# Altium project ImmPCB2.PRJPCB (part 2 of 2)

## Sheet Power.SchDoc
size A3
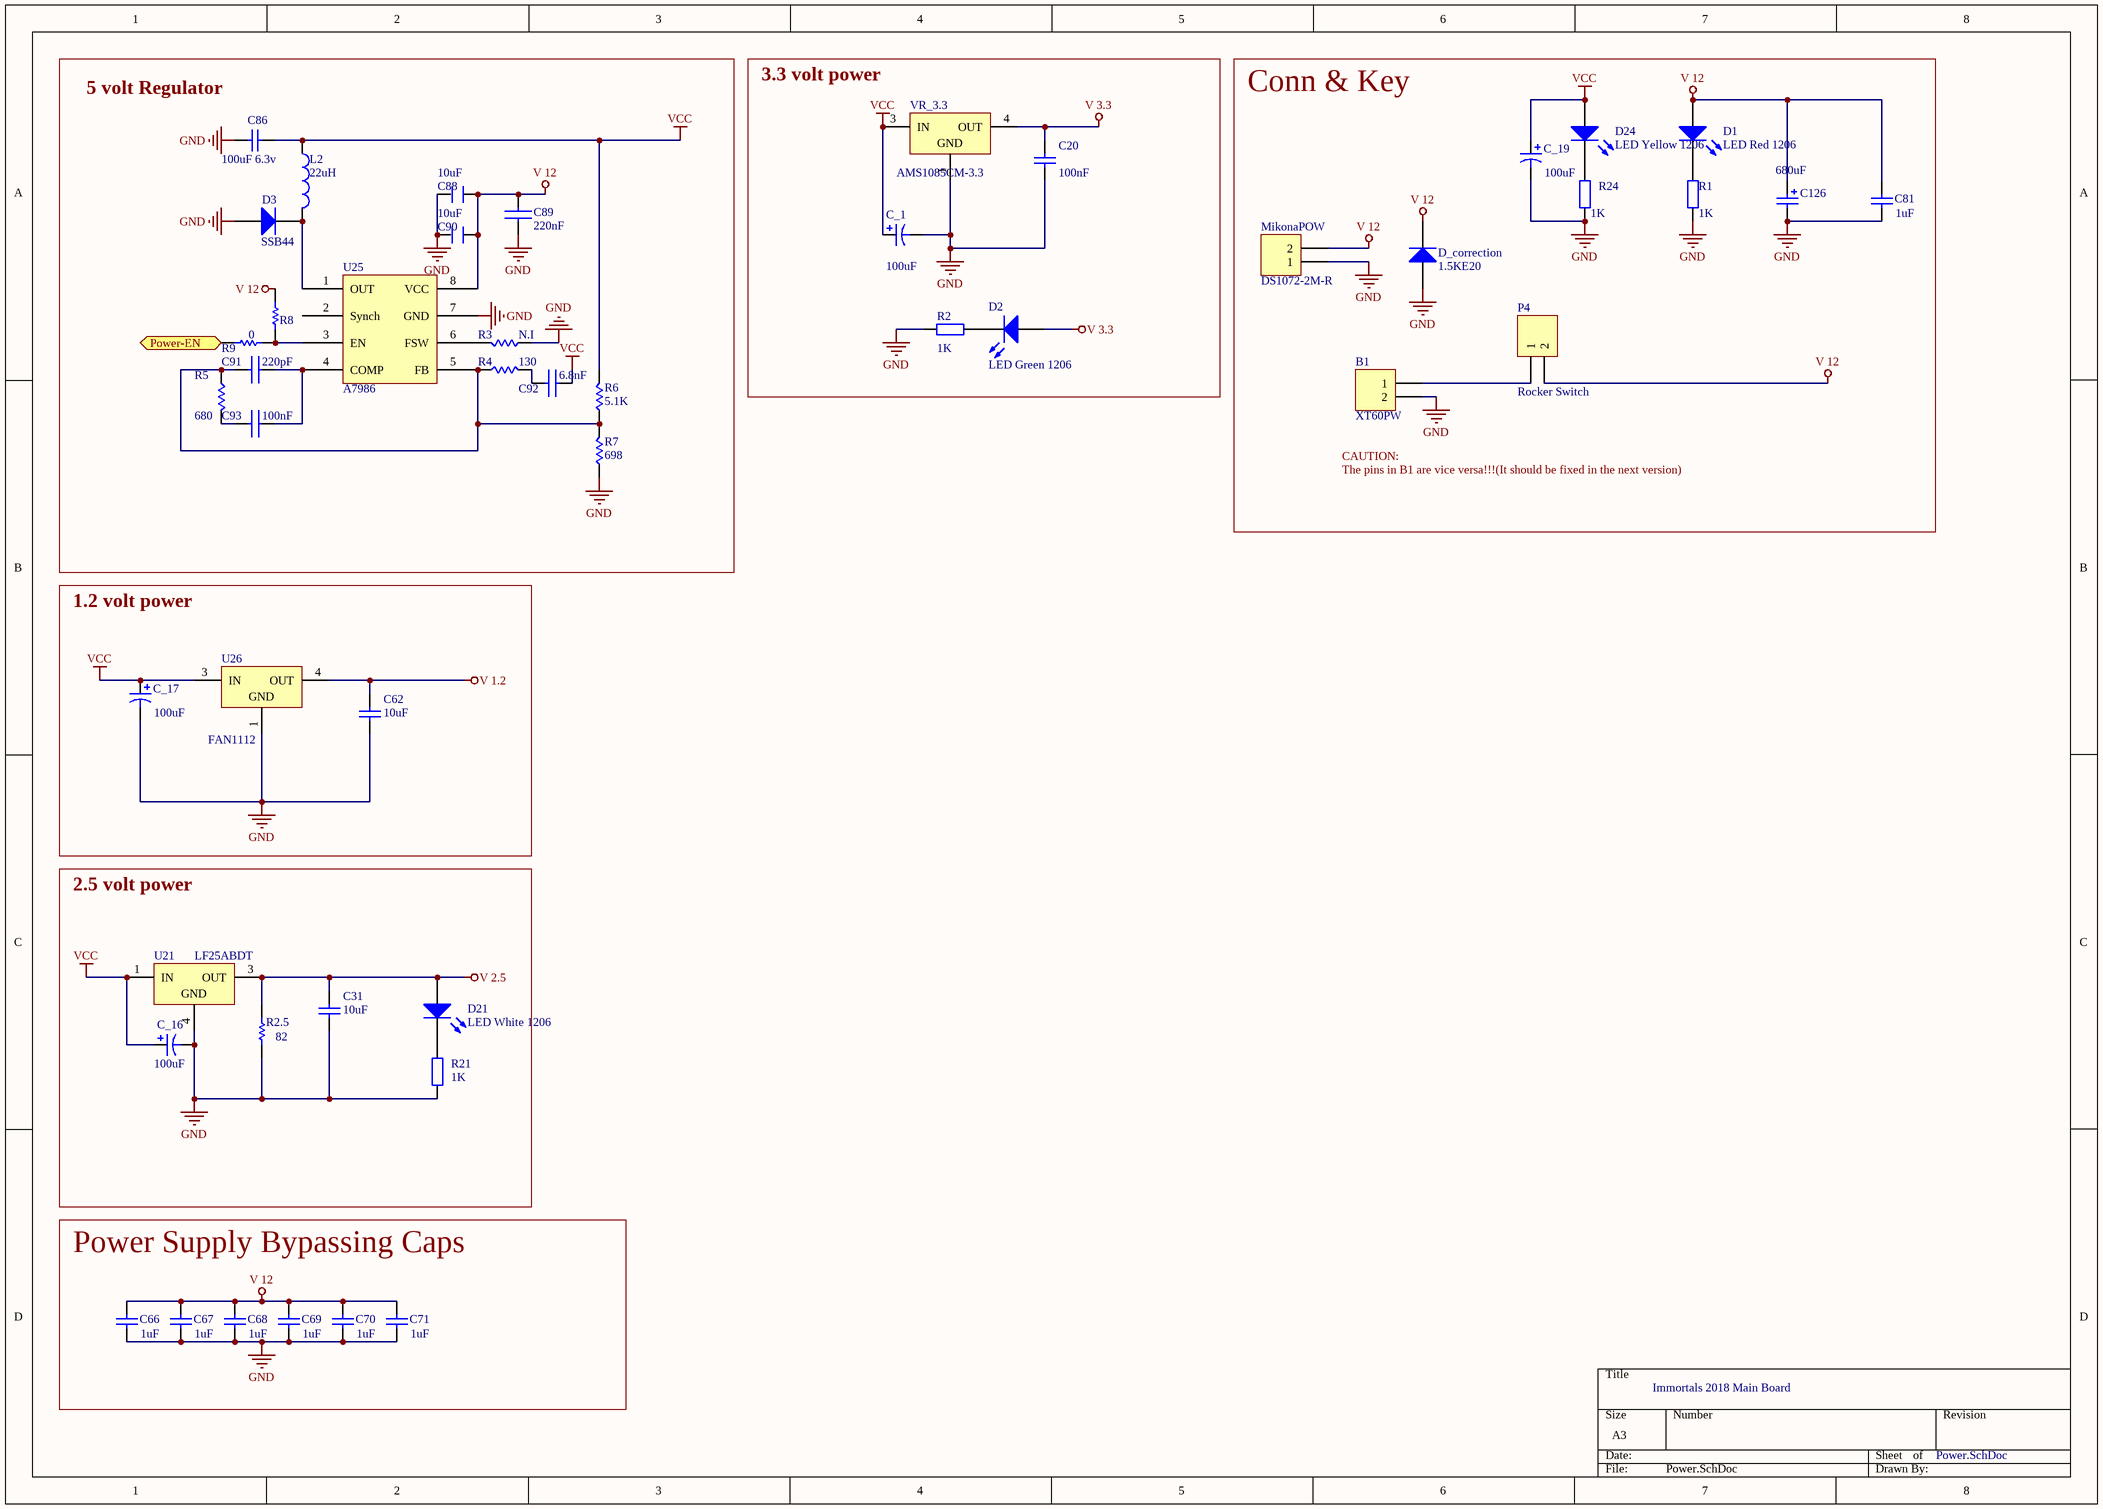
[diagram p4: Power.SchDoc]

### Parts
B1  XT60PW  [XT60PW]
C20  value 100nF  [C1206]  (hidden comment: Cap 100nF 1206)
C31  value 10uF  [C1206]  (hidden comment: Cap 10uF 1206)
C62  value 10uF  [C1206]  (hidden comment: Cap 10uF 1206)
C66  value 1uF  [C0805]  (hidden comment: Cap 1uF 0805)
C67  value 1uF  [C0805]  (hidden comment: Cap 1uF 0805)
C68  value 1uF  [C0805]  (hidden comment: Cap 1uF 0805)
C69  value 1uF  [C0805]  (hidden comment: Cap 1uF 0805)
C70  value 1uF  [C0805]  (hidden comment: Cap 1uF 0805)
C71  value 1uF  [C0805]  (hidden comment: Cap 1uF 0805)
C81  value 1uF  [C0805]  (hidden comment: Cap 1uF 0805)
C86  value 100uF 6.3v  [C1210]  (hidden comment: Cap 100uF 1210)
C88  value 10uF  [C[0805]]  (hidden comment: Cap 10uF 0805)
C89  value 220nF  [C0603]  (hidden comment: Cap 220nF 0603)
C90  value 10uF  [C[0805]]  (hidden comment: Cap 10uF 0805)
C91  value 220pF  [C0603]  (hidden comment: Cap 220pF 0603)
C92  value 6.8nF  [C0603]  (hidden comment: Cap 6.8nF 0603)
C93  value 100nF  [C0603]  (hidden comment: Cap 100nF 0603)
C126  value 680uF  [CAPPR5-5x5]  (hidden comment: Cap 680uF dip)
C_1  value 100uF  [6332[2512]]  (hidden comment: Cap 100uF 2512)
C_16  value 100uF  [6332[2512]]  (hidden comment: Cap 100uF 2512)
C_17  value 100uF  [6332[2512]]  (hidden comment: Cap 100uF 2512)
C_19  value 100uF  [6332[2512]]  (hidden comment: Cap 100uF 2512)
D1  LED Red 1206  [3.2X1.6X1.1 - RED]
D2  LED Green 1206  [3.2X1.6X1.1 - GREEN]
D3  SSB44  [DIOM4336X24N]
D21  LED White 1206  [3.2X1.6X1.1 - WHITE]
D24  LED Yellow 1206  [3.2X1.6X1.1 - YELLOW]
D_correction  1.5KE20  [DO-41]
L2  value 22uH  [INDP110100X50N]  (hidden comment: Inductor 22uH)
MikonaPOW  DS1072-2M-R  [DS1072-2M&F-R]
P4  Rocker Switch  [Rocker_SW]
R1  value 1K  [2012[0805]]  (hidden comment: Res 1K 0805)
R2  value 1K  [2012[0805]]  (hidden comment: Res 1K 0805)
R2.5  value 82  [3216[1206]]  (hidden comment: Res 82 1206)
R3  N.I  [R0603]
R4  value 130  [R0603]  (hidden comment: Res 130 0603)
R5  value 680  [R0603]  (hidden comment: Res 680 0603)
R6  value 5.1K  [R0603]  (hidden comment: Res 5.1K 0603)
R7  value 698  [R0603]  (hidden comment: Res 698 0603)
R8  N.I  [R0603]  (value not drawn)
R9  value 0  [R0603]  (hidden comment: Res 0 0603)
R21  value 1K  [2012[0805]]  (hidden comment: Res 1K 0805)
R24  value 1K  [2012[0805]]  (hidden comment: Res 1K 0805)
U21  LF25ABDT  [TO-252]
U25  A7986  [HSOP8]
U26  FAN1112  [TO-252]
VR_3.3  AMS1085CM-3.3  [936-03]

### Blocks framed on the sheet
5 volt Regulator: C86 C88-C93 D3 L2 R3-R9 U25
3.3 volt power: C20 C_1 D2 R2 VR_3.3
Conn & Key: B1 C81 C126 C_19 D1 D24 D_correction MikonaPOW P4 R1 R24
1.2 volt power: C62 C_17 U26
2.5 volt power: C31 C_16 D21 R2.5 R21 U21
Power Supply Bypassing Caps: C66-C71

### Ports
Power-EN (in)

### Nets
GND: B1.2 C20.2 C31.1 C62.1 C66.2 C67.2 C68.2 C69.2 C70.2 C71.2 C81.2 C86.1 C88.2 C89.2 C90.2 C126.2 C_1.2 C_16.2 C_17.2 C_19.2 D3.2(A) D_correction.1(A) MikonaPOW.1 R1.2 R2.1 R2.5.1 R3.1 R7.1 R21.1 R24.1 U21.4(GND) U25.7(GND) U26.1(GND) VR_3.3.1(GND)
V 1.2: C62.2 U26.4(OUT)
V 2.5: C31.2 D21.1(A) R2.5.2 U21.3(OUT)
V 3.3: C20.1 D2.1(A) VR_3.3.4(OUT)
V 12: C66.1 C67.1 C68.1 C69.1 C70.1 C71.1 C81.1 C88.1 C89.1 C90.1 C126.1 D1.1(A) D_correction.2(K) MikonaPOW.2 P4.2 R8.1 U25.8(VCC)
VCC: C86.2 C92.1 C_1.1 C_16.1 C_17.1 C_19.1 D24.1(A) L2.1 R6.2 U21.1(IN) U26.3(IN) VR_3.3.3(IN)
P0.05/AIN3: R9.1 ; port Power-EN
NetB1_1: B1.1 P4.1
NetC91_1: C91.1 R4.1 R5.1 R6.1 R7.2 U25.5(FB)
NetC91_2: C91.2 C93.2 U25.4(COMP)
NetC92_2: C92.2 R4.2
NetC93_1: C93.1 R5.2
NetD1_2: D1.2(K) R1.1
NetD2_2: D2.2(K) R2.2
NetD3_1: D3.1(K) L2.2 U25.1(OUT)
NetD21_2: D21.2(K) R21.2
NetD24_2: D24.2(K) R24.2
NetR3_2: R3.2 U25.6(FSW)
NetR8_2: R8.2 R9.2 U25.3(EN)

Not connected (* = marked no-connect by the designer): U25 2(Synch)

### Notes on the sheet
- The pins in B1 are vice versa!!!(It should be fixed in the next version)
- CAUTION:
- Immortals 2018 Main Board

### Library data of the parts
B1 = XT60PW: Power Connector; LatestRevisionDate: 17-Jul-2002; LatestRevisionNote: Re-released for DXP Platform.; Publisher: Altium Limited
C20 C31 C62 C86 = Cap Semi: Capacitor (Semiconductor SIM Model); Published: 8-Jun-2000; PackageReference: C1206; Publisher: Altium Limited
  C20 C31 C62: LatestRevisionDate: 17-Jul-2002; LatestRevisionNote: Re-released for DXP Platform.
  C86: LatestRevisionDate: 29-May-2009; LatestRevisionNote: IPC-7351 Footprint Added.; PackageDescription: Chip Capacitor
C66-C71 C81 = CAP: Capacitor; Fitted: True
C88 C90 = C: Cap , SMD; Part Field 1: 2064
C89 C91 C92 = Cap 0603: C0603
C93 = Cap 0603: Cap SMD 0603
C126 = Cap Pol1: Polarized Capacitor (Radial); Published: 8-Jun-2000; LatestRevisionDate: 17-Jul-2002; LatestRevisionNote: Re-released for DXP Platform.; PackageReference: RB7.6-15; Publisher: Altium Limited
C_1 C_16 C_17 C_19 = Cap Pol3: Polarized Capacitor (Surface Mount); Published: 8-Jun-2000; LatestRevisionDate: 17-Jul-2002; LatestRevisionNote: Re-released for DXP Platform.; PackageReference: C0805; Publisher: Altium Limited
D1 D2 D21 D24 = LED2: Typical RED, GREEN, YELLOW, AMBER GaAs LED; Published: 8-Jun-2000; LatestRevisionDate: 17-Jul-2002; LatestRevisionNote: Re-released for DXP Platform.; PackageDocument: Feb-2002; PackageReference: 3.2X1.6X1.1; Publisher: Altium Limited
D3 = Diode SSB44: 1 Amp General Purpose Rectifier; Published: 8-Jun-2000; LatestRevisionDate: 17-Jul-2002; LatestRevisionNote: Re-released for DXP Platform.; DatasheetDocument: 1998; PackageDocument: Aug-1999; PackageReference: DO-41; Publisher: Altium Limited; Code_JEDEC: DO-204-AL; ComponentLink1Description: Manufacturer Link; ComponentLink1URL: http://www.fairchildsemi.com/; ComponentLink2Description: Datasheet; ComponentLink2URL: http://www.fairchildsemi.com/ds/1N%2F1N4001.pdf
D_correction = Diode 1N4001: 1 Amp General Purpose Rectifier; Published: 8-Jun-2000; LatestRevisionDate: 17-Jul-2002; LatestRevisionNote: Re-released for DXP Platform.; DatasheetDocument: 1998; PackageDocument: Aug-1999; PackageReference: DO-41; Publisher: Altium Limited; Code_JEDEC: DO-204-AL; ComponentLink1Description: Manufacturer Link; ComponentLink1URL: http://www.fairchildsemi.com/; ComponentLink2Description: Datasheet; ComponentLink2URL: http://www.fairchildsemi.com/ds/1N%2F1N4001.pdf
L2 = 7447714220 WE-PD SMD
MikonaPOW = Header 2: Right Angle 3.96mm Power pin; LatestRevisionDate: 17-Jul-2002; LatestRevisionNote: Re-released for DXP Platform.; Publisher: Altium Limited; Value: DS1072-2M-R
P4 = Rocker_SW: I/O Power Switch; LatestRevisionDate: 17-Jul-2002; LatestRevisionNote: Re-released for DXP Platform.; Publisher: Altium Limited
R1 R2 R21 R24 = Res2: Resistor; Published: 8-Jun-2000; LatestRevisionDate: 17-Jul-2002; LatestRevisionNote: Re-released for DXP Platform.; PackageReference: AXIAL-0.4; Publisher: Altium Limited
R2.5 = Res Semi: Semiconductor Resistor; Published: 8-Jun-2000; LatestRevisionDate: 17-Jul-2002; LatestRevisionNote: Re-released for DXP Platform.; PackageReference: AXIAL-0.5; Publisher: Altium Limited
R3-R7 = Res 0603
  R3: Value: N.I
R8 R9 = R0603: Res 0603; Part Field 1: 3144
  R8: Value: N.I
U21 = LF25ABDT: 500mA, Very Low Drop (0.45V) Voltage Regulator; Published: 24-Aug-2001; LatestRevisionDate: 06-Jun-2005; LatestRevisionNote: PCB pads lengthened.; DatasheetVersion: Feb-2004; PackageVersion: Jun-2004; PackageReference: TO-252; Publisher: Altium Limited; PackageDescription: D-PAK/TO-252-AA; 3 Leads (1 Cropped); Body 10.1 (inc. leads) x 6.6 mm (LxW max); ComponentLink1Description: Manufacturer Link; ComponentLink1URL: http://www.st.com/; ComponentLink2Description: Datasheet; ComponentLink2URL: http://www.st.com/stonline/books/pdf/docs/2574.pdf
U25 = A7986: DC\DC Regulator
U26 = FAN1112: 500mA, Very Low Drop (0.45V) Voltage Regulator; Published: 24-Aug-2001; LatestRevisionDate: 06-Jun-2005; LatestRevisionNote: PCB pads lengthened.; DatasheetVersion: Feb-2004; PackageVersion: Jun-2004; PackageReference: TO-252; Publisher: Altium Limited; PackageDescription: D-PAK/TO-252-AA; 3 Leads (1 Cropped); Body 10.1 (inc. leads) x 6.6 mm (LxW max); ComponentLink1Description: Manufacturer Link; ComponentLink1URL: http://www.st.com/; ComponentLink2Description: Datasheet; ComponentLink2URL: http://www.st.com/stonline/books/pdf/docs/2574.pdf
VR_3.3 = LT1585ACM-1.5: 5A Low Dropout Fast Response Positive Fixed Voltage Regulator; Published: 15-Apr-2002; DatasheetVersion: 1999; PackageVersion: 1997; PackageReference: 936-03; Publisher: Altium Limited; PackageDescription: D2-PAK/TO-263-AB; 3 Leads (1 Cropped); Body 14.7 (inc. leads) x 10.2 mm (LxW max); ComponentLink1Description: Manufacturer Link; ComponentLink1URL: http://www.onsemi.com/site/products/taxonomy/0,4438,503,00.html

## Sheet Switches.SchDoc
size A4
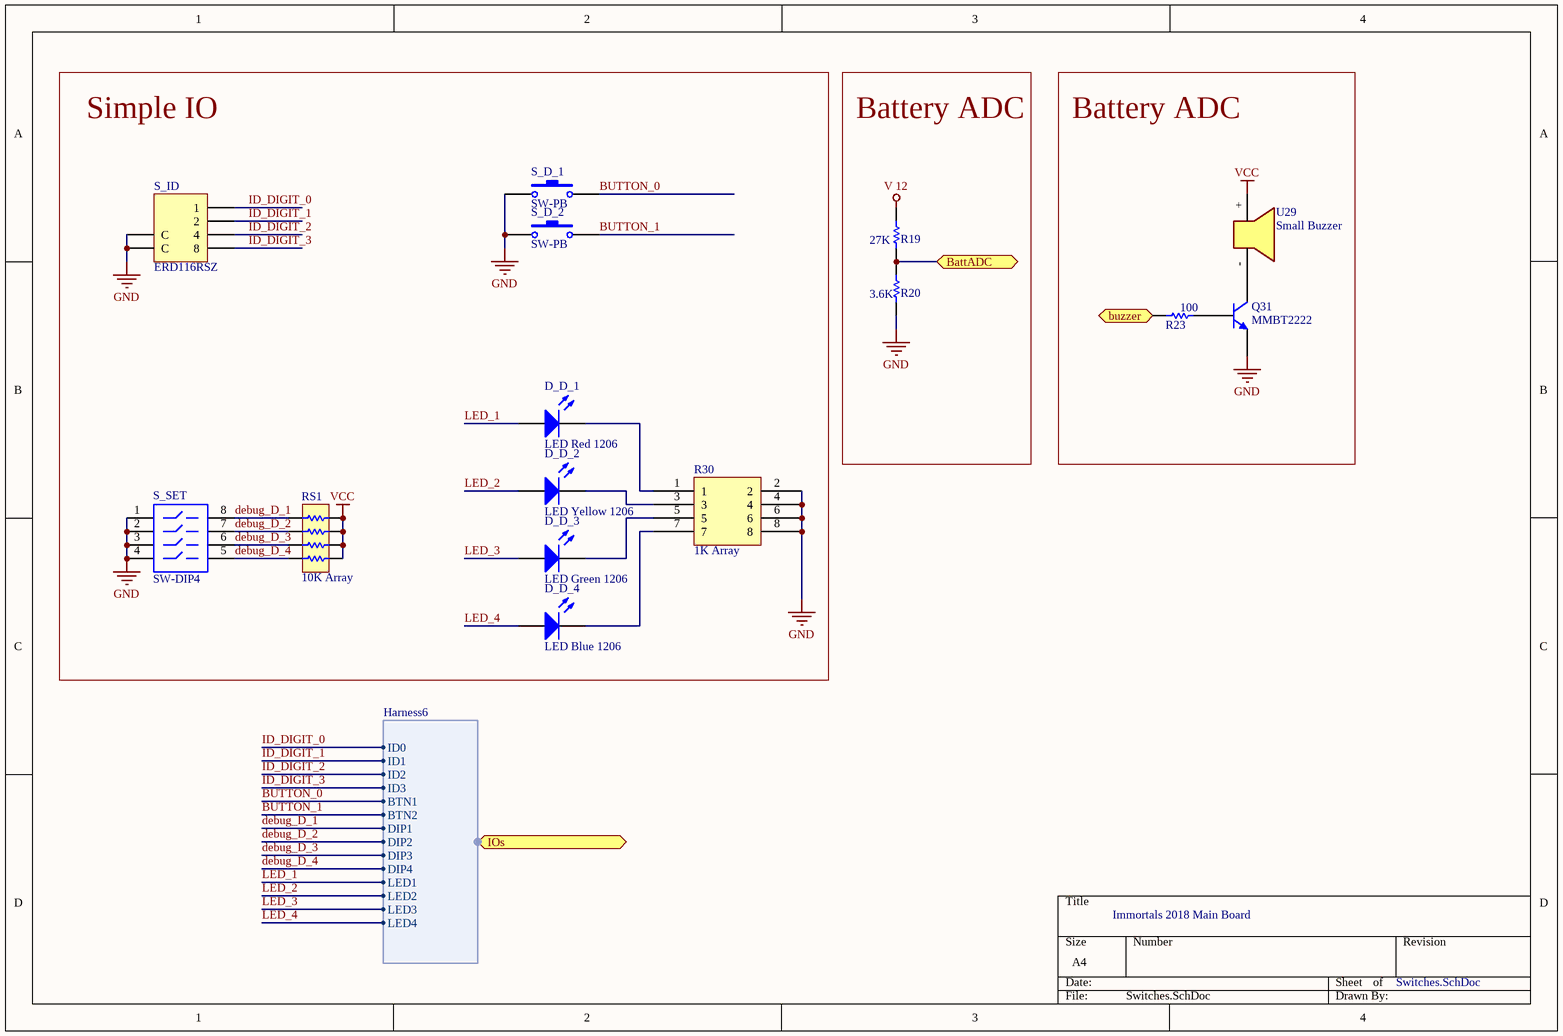
[diagram p5: Switches.SchDoc]

### Parts
D_D_1  LED Red 1206  [3.2X1.6X1.1 - RED]
D_D_2  LED Yellow 1206  [3.2X1.6X1.1 - YELLOW]
D_D_3  LED Green 1206  [3.2X1.6X1.1 - GREEN]
D_D_4  LED Blue 1206  [3.2X1.6X1.1 - BLUE]
Q31  MMBT2222  [SOT23]
R19  value 27K  [R0603]  (hidden comment: Res 27K 0603)
R20  value 3.6K  [R0603]  (hidden comment: Res 3.6K 0603)
R23  value 100  [R0603]  (hidden comment: Res 100 0603)
R30  1K Array  [RES-0603x4]
RS1  10K Array  [RES-4B]
S_D_1  SW-PB  [SPST-2]
S_D_2  SW-PB  [SPST-2]
S_ID  ERD116RSZ  [ERD116RSZ]
S_SET  SW-DIP4  [DIP-8-SW]
U29  Small Buzzer  [my_BUZZER]

### Blocks framed on the sheet
Simple IO: D_D_1-D_D_4 R30 RS1 S_D_1 S_D_2 S_ID S_SET
Battery ADC: R19 R20
Battery ADC: Q31 R23 U29

### Ports
BattADC, buzzer, IOs (harness Harness6)

### Harnesses
Harness6: ID0, ID1, ID2, ID3, BTN1, BTN2, DIP1, DIP2, DIP3, DIP4, LED1, LED2, LED3, LED4

### Nets
GND: Q31.2(E) R20.1 R30.2 R30.4 R30.6 R30.8 S_D_1.1 S_D_2.1 S_ID.2(C) S_ID.5(C) S_SET.1 S_SET.2 S_SET.3 S_SET.4
V 12: R19.2
VCC: RS1.1 RS1.3 RS1.5 RS1.7 U29.+
BT-ADC: R19.1 R20.2 ; port BattADC
BUTTON_0: S_D_1.2 ; port IOs.BTN1  [project net BTN1]
BUTTON_1: S_D_2.2 ; port IOs.BTN2  [project net BTN2]
buzzer: R23.2 ; port buzzer
debug_D_1: RS1.8 S_SET.8 ; port IOs.DIP1  [project net D_IO2]
debug_D_2: RS1.6 S_SET.7 ; port IOs.DIP2  [project net D_IO3]
debug_D_3: RS1.4 S_SET.6 ; port IOs.DIP3  [project net D_IO4]
debug_D_4: RS1.2 S_SET.5 ; port IOs.DIP4  [project net D_IO5]
ID_DIGIT_0: S_ID.1 ; port IOs.ID0  [project net ID0]
ID_DIGIT_1: S_ID.4(2) ; port IOs.ID1  [project net ID1]
ID_DIGIT_2: S_ID.3(4) ; port IOs.ID2  [project net ID2]
ID_DIGIT_3: S_ID.6(8) ; port IOs.ID3  [project net ID3]
LED_1: D_D_1.1(A) ; port IOs.LED1  [project net LED1]
LED_2: D_D_2.1(A) ; port IOs.LED2  [project net LED2]
LED_3: D_D_3.1(A) ; port IOs.LED3  [project net LED3]
LED_4: D_D_4.1(A) ; port IOs.LED4  [project net D_IO6]
NetD_D_1_2: D_D_1.2(K) R30.1
NetD_D_2_2: D_D_2.2(K) R30.3
NetD_D_3_2: D_D_3.2(K) R30.5
NetD_D_4_2: D_D_4.2(K) R30.7
NetQ31_1: Q31.1(B) R23.1
NetQ31_3: Q31.3(C) U29.-

### Notes on the sheet
- Immortals 2018 Main Board

### Library data of the parts
D_D_1-D_D_4 = LED2: as D1 on sheet Power; Published: 8-Jun-2000; LatestRevisionDate: 17-Jul-2002; LatestRevisionNote: Re-released for DXP Platform.; PackageDocument: Feb-2002; PackageReference: 3.2X1.6X1.1; Publisher: Altium Limited
Q31 = MMBT2222ALT1: Transistor NPN Silicon,SMD; Value: MMBT3904; Published: 29-Sep-2000; LatestRevisionDate: 17-Jul-2002; LatestRevisionNote: Re-released for DXP Platform.; DatasheetVersion: 1996; PackageVersion: 1997; PackageReference: 318-08; Publisher: Altium Limited; PackageDescription: SOT-23; 3 Leads; Body 3.0 x 2.6 mm, inc. leads (LxW max); ComponentLink1Description: Manufacturer Link; ComponentLink1URL: http://www.onsemi.com/site/products/landing?taxonomyID=194; ComponentLink2Description: Datasheet; ComponentLink2URL: http://www.onsemi.com/pub/Collateral/MMBT2222LT1-D.PDF
R19 R20 R23 = R0603: Res 0603; Part Field 1: 3144
R30 = RES 0603x4: Array resistors; Value: 1K
RS1 = Resister Array: Resistor Array ,SMD
S_D_1 S_D_2 = SW-PB: Switch; Value: Mini push button; Published: 24-Mar-1999; LatestRevisionDate: 17-Jul-2002; LatestRevisionNote: Re-released for DXP Platform.; PackageReference: SPST-2; Publisher: Altium Limited
S_ID = Rotary Switch: Value: ERD116RSZ
S_SET = SW-DIP4: DIP Switch; Published: 24-Mar-1999; LatestRevisionDate: 17-Jul-2002; LatestRevisionNote: Re-released for DXP Platform.; PackageReference: DIP-8; Publisher: Altium Limited
U29 = my_Buzzer

## Sheet NRF&Gyro.SchDoc
size A
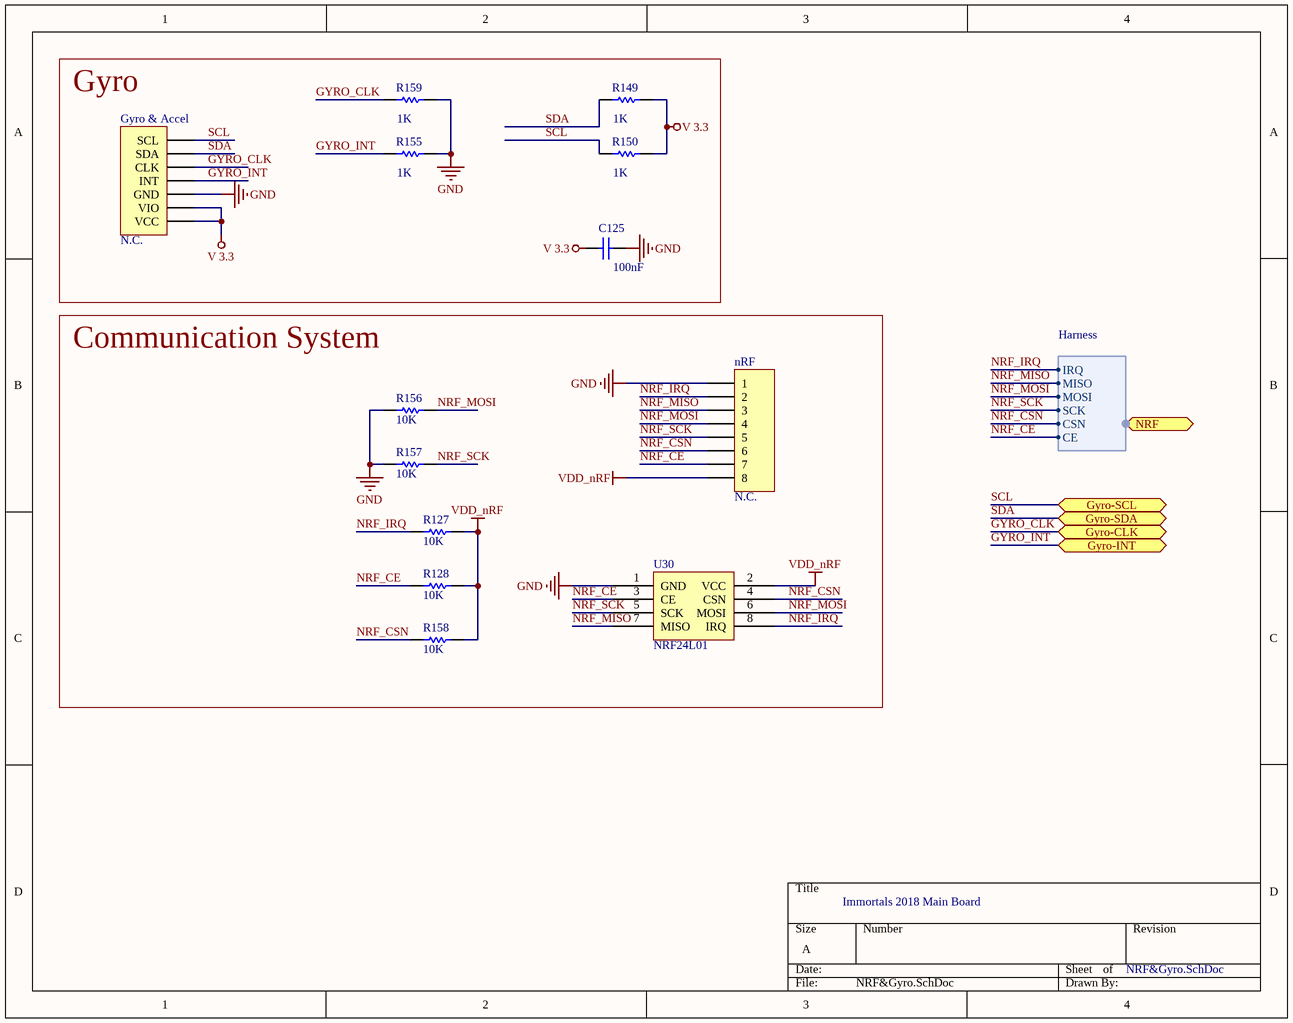
[diagram p6: NRF&Gyro.SchDoc]

### Parts
C125  value 100nF  [C1206]  (hidden comment: Cap 100nF 1206)
Gyro_&_Accel  N.C.  [Gyro_7pin]
nRF  N.C.  [HDR1X8]
R127  value 10K  [1608[0603]]  (hidden comment: Res 10K 0603)
R128  value 10K  [1608[0603]]  (hidden comment: Res 10K 0603)
R149  value 1K  [1608[0603]]  (hidden comment: Res 1K 0603)
R150  value 1K  [1608[0603]]  (hidden comment: Res 1K 0603)
R155  value 1K  [1608[0603]]  (hidden comment: Res 1K 0603)
R156  value 10K  [1608[0603]]  (hidden comment: Res 10K 0603)
R157  value 10K  [1608[0603]]  (hidden comment: Res 10K 0603)
R158  value 10K  [1608[0603]]  (hidden comment: Res 10K 0603)
R159  value 1K  [1608[0603]]  (hidden comment: Res 1K 0603)
U30  NRF24L01  [NRF24L01]

### Blocks framed on the sheet
Gyro: C125 Gyro_&_Accel R149 R150 R155 R159
Communication System: nRF R127 R128 R156-R158 U30

### Ports
Gyro-CLK, Gyro-INT, Gyro-SCL, Gyro-SDA, NRF (harness Harness)

### Harnesses
Harness: IRQ, MISO, MOSI, SCK, CSN, CE

### Nets
GND: C125.2 Gyro_&_Accel.5(GND) nRF.1 R155.2 R156.2 R157.2 R159.2 U30.1(GND)
V 3.3: C125.1 Gyro_&_Accel.6(VIO) Gyro_&_Accel.7(VCC) R149.1 R150.1
VDD_nRF: nRF.8 R127.1 R128.1 R158.1 U30.2(VCC)
GYRO_CLK: Gyro_&_Accel.3(CLK) R159.1 ; port Gyro-CLK  [project net Gyro2]
GYRO_INT: Gyro_&_Accel.4(INT) R155.1 ; port Gyro-INT  [project net Gyro1]
NRF_CE: nRF.7 R128.2 U30.3(CE) ; port NRF.CE  [project net D_IO15_1]
NRF_CSN: nRF.6 R158.2 U30.4(CSN) ; port NRF.CSN  [project net D_IO14]
NRF_IRQ: nRF.2 R127.2 U30.8(IRQ) ; port NRF.IRQ  [project net D_IO10]
NRF_MISO: nRF.3 U30.7(MISO) ; port NRF.MISO  [project net D_IO11]
NRF_MOSI: nRF.4 R156.1 U30.6(MOSI) ; port NRF.MOSI  [project net D_IO12]
NRF_SCK: nRF.5 R157.1 U30.5(SCK) ; port NRF.SCK  [project net D_IO13]
SCL: Gyro_&_Accel.1(SCL) R150.2 ; port Gyro-SCL  [project net Gyro4]
SDA: Gyro_&_Accel.2(SDA) R149.2 ; port Gyro-SDA  [project net Gyro3]

### Notes on the sheet
- Immortals 2018 Main Board

### Library data of the parts
C125 = CAP: Capacitor; Fitted: True
Gyro_&_Accel = Gyroscope: Comp & Gyro
nRF = Header 8: Header, 8-Pin; LatestRevisionDate: 17-Jul-2002; LatestRevisionNote: Re-released for DXP Platform.; Publisher: Altium Limited
R127 R128 R149 R150 R155-R159 = Res Semi: Semiconductor Resistor; Published: 8-Jun-2000; LatestRevisionDate: 17-Jul-2002; LatestRevisionNote: Re-released for DXP Platform.; PackageReference: AXIAL-0.5; Publisher: Altium Limited

## Sheet MCU.SchDoc
size A
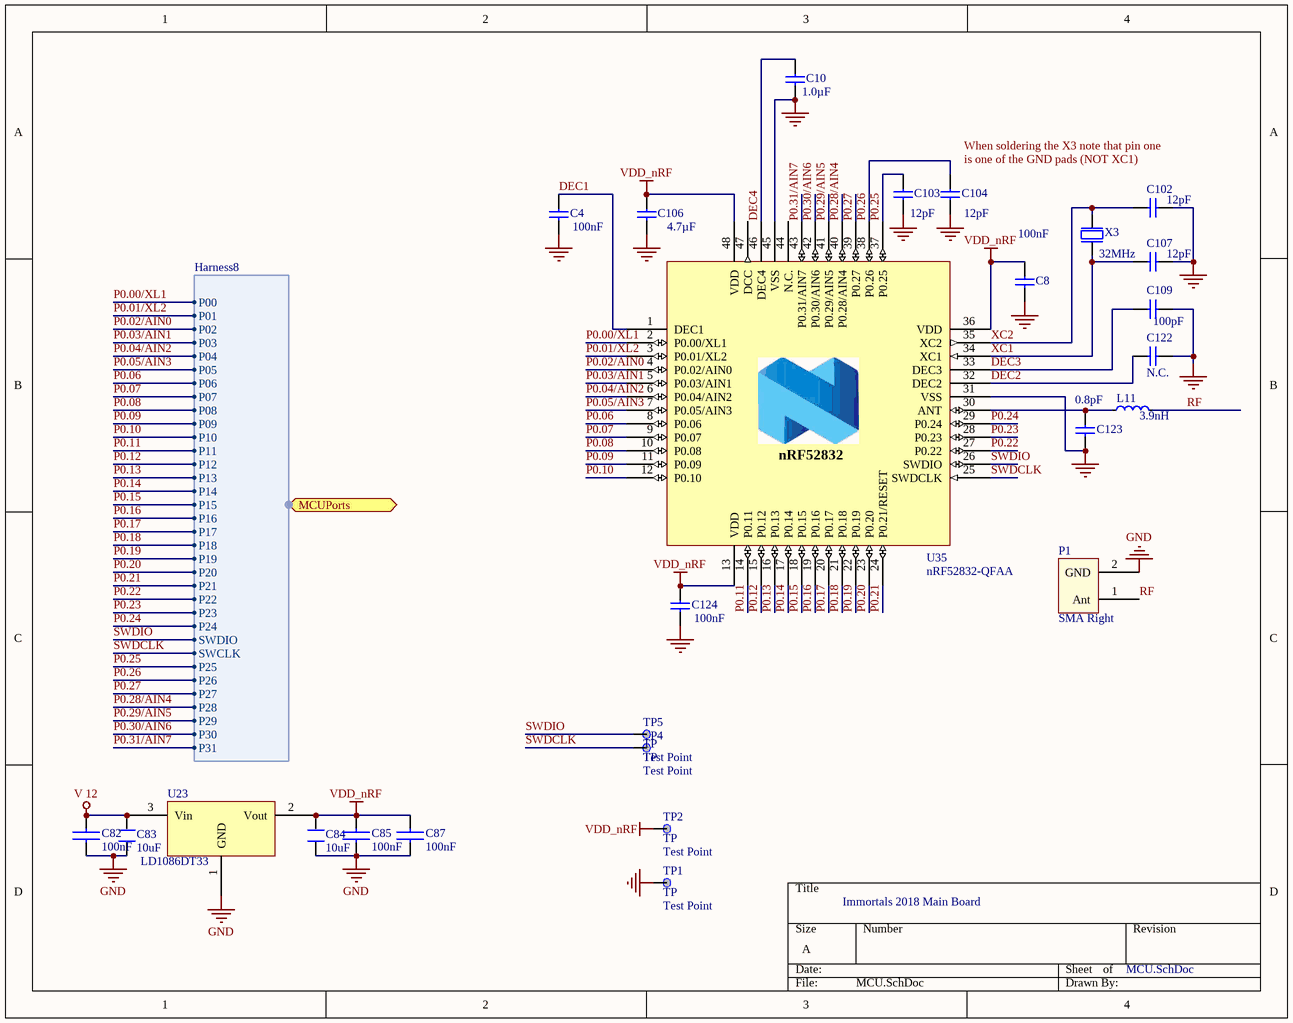
[diagram p7: MCU.SchDoc]

### Parts
C4  value 100nF  [CAPC1005X04L]  (hidden comment: Cap 100nF 0402)
C8  value 100nF  [CAPC1005X04L]  (hidden comment: Cap 100nF 0402)
C10  value 1.0µF  [CAPC1608X06L]  (hidden comment: Cap 1uF 0603)
C82  value 100nF  [C0603]  (hidden comment: Cap 100nF 0603)
C83  value 10uF  [C1206]  (hidden comment: Cap 10uF 1206)
C84  value 10uF  [C1206]  (hidden comment: Cap 10uF 1206)
C85  value 100nF  [C0603]  (hidden comment: Cap 100nF 0603)
C87  value 100nF  [C0603]  (hidden comment: Cap 100nF 0603)
C102  value 12pF  [CAPC1005X04L]  (hidden comment: Cap 12pF 0402)
C103  value 12pF  [CAPC1005X04L]  (hidden comment: Cap 12pF 0402)
C104  value 12pF  [CAPC1005X04L]  (hidden comment: Cap 12pF 0402)
C106  value 4.7µF  [CAPC1608X06L]  (hidden comment: Cap 4.7uF 0603)
C107  value 12pF  [CAPC1005X04L]  (hidden comment: Cap 12pF 0402)
C109  value 100pF  [CAPC1005X04L]  (hidden comment: Cap 100pF 0402)
C122  N.C.  [CAPC1005X04L]
C123  value 0.8pF  [CAPC1005X04L]  (hidden comment: Cap 0.8pF 0402)
C124  value 100nF  [CAPC1005X04L]  (hidden comment: Cap 100nF 0402)
L11  value 3.9nH  [INDC1005X04L]  (hidden comment: Inductor 3.9nH 0402)
P1  SMA Right  [SMA Right]
TP1  TP  value Test Point  [TP]
TP2  TP  value Test Point  [TP]
TP4  TP  value Test Point  [TP]
TP5  TP  value Test Point  [TP]
U23  LD1086DT33  [DPAK]
U35  nRF52832-QFAA  [QFN40P600X600X90-48N]
X3  value 32MHz  [BT-XTAL_2016]  (hidden comment: XTAL 32MHz)

### Ports
MCUPorts (harness Harness8)

### Harnesses
Harness8: P02, P03, P04, P05, P06, P07, P08, P09, P10, P11, P12, P13, P14, P15, P16, P17, P18, P19, P20, P21, P24, P23, P22, SWDIO, SWCLK, P25, P26, P27, P28, P29, P30, P31, P01, P00

### Nets
GND: C4.2 C8.2 C10.1 C82.1 C83.1 C84.1 C85.1 C87.1 C102.2 C103.2 C104.2 C106.2 C107.2 C109.2 C122.1 C123.1 C124.2 P1.2(GND) TP1.1 U23.1(GND) U35.31(VSS) U35.45(VSS) U35.49(GND) X3.2(GND) X3.4(GND)
V 12: C82.2 C83.2 U23.3(Vin)
VDD_nRF: C8.1 C84.2 C85.2 C87.2 C106.1 C124.1 TP2.1 U23.2(Vout) U35.13(VDD) U35.36(VDD) U35.48(VDD)
DEC1: C4.1 U35.1(DEC1)
DEC2: C122.2 U35.32(DEC2)
DEC3: C109.1 U35.33(DEC3)
DEC4: C10.2 U35.46(DEC4)
P0.00/XL1: U35.2(P0.00/XL1) ; port MCUPorts.P00
P0.01/XL2: U35.3(P0.01/XL2) ; port MCUPorts.P01
P0.02/AIN0: U35.4(P0.02/AIN0) ; port MCUPorts.P02  [project net CUR_M3]
P0.03/AIN1: U35.5(P0.03/AIN1) ; port MCUPorts.P03  [project net CUR_M2]
P0.04/AIN2: U35.6(P0.04/AIN2) ; port MCUPorts.P04  [project net CUR_MD]
P0.05/AIN3: U35.7(P0.05/AIN3) ; port MCUPorts.P05
P0.06: U35.8(P0.06) ; port MCUPorts.P06  [project net D_IO15_1]
P0.07: U35.9(P0.07) ; port MCUPorts.P07  [project net D_IO14]
P0.08: U35.10(P0.08) ; port MCUPorts.P08  [project net D_IO13]
P0.09: U35.11(P0.09) ; port MCUPorts.P09  [project net D_IO12]
P0.10: U35.12(P0.10) ; port MCUPorts.P10  [project net D_IO11]
P0.11: U35.14(P0.11) ; port MCUPorts.P11  [project net D_IO10]
P0.12: U35.15(P0.12) ; port MCUPorts.P12  [project net D_IO9]
P0.13: U35.16(P0.13) ; port MCUPorts.P13  [project net D_IO8]
P0.14: U35.17(P0.14) ; port MCUPorts.P14  [project net D_IO7]
P0.15: U35.18(P0.15) ; port MCUPorts.P15  [project net BTN1]
P0.16: U35.19(P0.16) ; port MCUPorts.P16  [project net BTN2]
P0.17: U35.20(P0.17) ; port MCUPorts.P17  [project net ID1]
P0.18: U35.21(P0.18) ; port MCUPorts.P18  [project net ID2]
P0.19: U35.22(P0.19) ; port MCUPorts.P19  [project net ID3]
P0.20: U35.23(P0.20) ; port MCUPorts.P20  [project net ID0]
P0.21: U35.24(P0.21/RESET) ; port MCUPorts.P21  [project net LED1]
P0.22: U35.27(P0.22) ; port MCUPorts.P22  [project net LED2]
P0.23: U35.28(P0.23) ; port MCUPorts.P23  [project net LED3]
P0.24: U35.29(P0.24) ; port MCUPorts.P24  [project net buzzer]
P0.25: C103.1 U35.37(P0.25) ; port MCUPorts.P25
P0.26: C104.1 U35.38(P0.26) ; port MCUPorts.P26
P0.27: U35.39(P0.27) ; port MCUPorts.P27
P0.28/AIN4: U35.40(P0.28/AIN4) ; port MCUPorts.P28  [project net BT-ADC]
P0.29/AIN5: U35.41(P0.29/AIN5) ; port MCUPorts.P29  [project net CAP_ADC]
P0.30/AIN6: U35.42(P0.30/AIN6) ; port MCUPorts.P30  [project net CUR_M4]
P0.31/AIN7: U35.43(P0.31/AIN7) ; port MCUPorts.P31  [project net CUR_M1]
RF: L11.2 P1.1(Ant)
SWDCLK: TP4.1 U35.25(SWDCLK) ; port MCUPorts.SWCLK
SWDIO: TP5.1 U35.26(SWDIO) ; port MCUPorts.SWDIO
XC1: C107.1 U35.34(XC1) X3.1(inp)
XC2: C102.1 U35.35(XC2) X3.3(out)
NetC123_2: C123.2 L11.1 U35.30(ANT)

Not connected (* = marked no-connect by the designer): U35 44(N.C.) 47(DCC)

### Notes on the sheet
- When soldering the X3 note that pin one
- is one of the GND pads (NOT XC1)
- Immortals 2018 Main Board
- (in symbol nRF52832-QFAA) nRF52832

### Library data of the parts
C4 C8 C124 = C0402-100n: Capacitor, X7R, ±10%; Note: 16V; Artikkelnr Noca: 20039200; Artikkelnr Simpro: N.A.; Part Number: C0402-100n; Manufacturer: *; Manufacturer Part Number: *; Datasheet: *; LatestRevisionDate: 2009-11-23; Pin Count: 2; Publisher: Nordic Semiconductor; Published: 2009-05-08; Supplier: *; Supplier part number: *; 2nd source Supplier: *; 2nd source part number: *; Footprint Doc: 0402
C10 = C0603-1µ0: Capacitor, X7R, ±10%; Note: 16V; Artikkelnr Noca: 20039335; Artikkelnr Simpro: N.A.; Part Number: C0603-1µ0; Manufacturer: *; Manufacturer Part Number: *; Datasheet: *; LatestRevisionDate: 2013-06-05; Pin Count: 2; Publisher: Nordic Semiconductor; Published: 2009-05-08; Supplier: *; Supplier part number: *; 2nd source Supplier: *; 2nd source part number: *; Footprint Doc: 0603
C82 C85 C87 = C0603
C83 C84 = C1206: Part Field 1: 2064
C102-C104 C107 = C0402-12p: Capacitor, NP0, ±2%; Note: 50V; Artikkelnr Noca: 20029159; Artikkelnr Simpro: N.A.; Part Number: C0402-12p; Manufacturer: *; Manufacturer Part Number: *; Datasheet: *; LatestRevisionDate: 2011-05-11; Pin Count: 2; Publisher: Nordic Semiconductor; Published: 2009-05-08; Supplier: *; Supplier part number: *; 2nd source Supplier: *; 2nd source part number: *; Footprint Doc: 0402
C106 = C0603-4µ7: Capacitor, X5R, ±10%; Note: 6.3V; Artikkelnr Noca: 20069060; Artikkelnr Simpro: N.A.; Part Number: C0603-4µ7; Manufacturer: *; Manufacturer Part Number: *; Datasheet: *; LatestRevisionDate: 2009-11-23; Pin Count: 2; Publisher: Nordic Semiconductor; Published: 2009-05-08; Supplier: *; Supplier part number: *; 2nd source Supplier: *; 2nd source part number: *; Footprint Doc: 0603
C109 = C0402-100p: Capacitor, NP0, ±5%; Note: 50V; Artikkelnr Noca: 20029135; Artikkelnr Simpro: N.A.; Part Number: C0402-100p; Manufacturer: *; Manufacturer Part Number: *; Datasheet: *; LatestRevisionDate: 2009-05-08; Pin Count: 2; Publisher: Nordic Semiconductor; Published: 2009-05-08; Supplier: *; Supplier part number: *; 2nd source Supplier: *; 2nd source part number: *; Footprint Doc: 0402
C122 = C0402-N.C.: Not mounted; Note: Chip Cap; Artikkelnr Noca: N.A.; Part Number: C0402-N.C.; Manufacturer: *; Manufacturer Part Number: *; Datasheet: *; LatestRevisionDate: 2009-05-08; Pin Count: 2; Publisher: Nordic Semiconductor; Published: 2009-05-08; Value: N.C.; Supplier: *; Supplier part number: *; 2nd source Supplier: *; 2nd source part number: *; Footprint Doc: 0402; Artikkelnr Simpro: N.A.
C123 = C0402-0.8p: Capacitor, NP0, ±5%; Note: 50V; Artikkelnr Noca: 20029147; Artikkelnr Simpro: N.A.; Part Number: C0402-0.8p; Manufacturer: *; Manufacturer Part Number: *; Datasheet: *; LatestRevisionDate: 2012-11-21; Pin Count: 2; Publisher: Nordic Semiconductor; Published: 2009-05-08; Supplier: *; Supplier part number: *; 2nd source Supplier: *; 2nd source part number: *; Footprint Doc: 0402
L11 = L0402-3n9: High frequency chip inductor ±5%; Manufacturer: Murata; Manufacturer Part Number: LQP15MN3N9B02D; Artikkelnr Noca: 33029151; Artikkelnr Simpro: N.A.; Part Number: L0402-3n9; Datasheet: http://search.murata.co.jp/Ceramy/image/img/PDF/ENG/L0075S0084LQP15M.pdf; LatestRevisionDate: 2012-09-19; Pin Count: 2; Publisher: Nordic Semiconductor; Published: 2009-05-08; Note: High frequency chip inductor ±5%; Supplier: Digi-Key; Supplier part number: 490-1131-1-ND; 2nd source Supplier: *; 2nd source part number: *; Footprint Doc: 0402
TP1 TP2 TP4 TP5 = TP: Test Point
U23 = LD1086: LD1086DT33 DPAK; Output: 3.3V; Value: LD1086DT33
U35 = nRF52832-QFAA: Multi-protocol Bluetooth Low Energy, ANT and 2.4GHz proprietary system-on-chip; Manufacturer: Nordic Semiconductor; Artikkelnr Noca: N.A.; Part Number: nRF52832-QFAA; Manufacturer Part Number: nRF52832-QFAA; Datasheet: *; LatestRevisionDate: 2014-11-26; Pin Count: 48; Publisher: Nordic Semiconductor; Published: 2014-11-26; Value: nRF52832-QFAA; Note: *; Supplier: Nordic Semiconductor; Supplier part number: *; 2nd source Supplier: *; 2nd source part number: *; Footprint Doc: QFN-48; Artikkelnr Simpro: N.A.
X3 = XTAL_SMD2016_32MHz_8pF_General: XTAL SMD 2016, 32MHz, Cl=8pF, Total Tol: ±40ppm; Note: XTAL SMD 32.000MHz; Artikkelnr Noca: N.A.; Part Number: XTAL_SMD2016_32MHz_8pF_General; Manufacturer: *; Manufacturer Part Number: *; Datasheet: *; LatestRevisionDate: 2016-08-19; Pin Count: 4; Publisher: Nordic Semiconductor; Published: 2016-08-19; Supplier: *; Supplier part number: *; 2nd source Supplier: *; 2nd source part number: *; Footprint Doc: XTAL_2016; Artikkelnr Simpro: N.A.

## Nets that join several sheets
GND: FPGA (137 pins), Motors&Drivers (100 pins), Dribbler (23 pins), Power (34 pins), Switches (14 pins), NRF&Gyro (8 pins), MCU (25 pins)
V 1.2: FPGA (9 pins), Power (C62.2 U26.4)
V 2.5: FPGA (11 pins), Power (C31.2 D21.1 R2.5.2 U21.3)
V 3.3: FPGA (49 pins), Power (C20.1 D2.1 VR_3.3.4), NRF&Gyro (5 pins)
V 12: FPGA (C_IR.1 R44.2 U22.6), Motors&Drivers (8 pins), Dribbler (U28.3 U28.4), Power (17 pins), Switches (R19.2), MCU (C82.2 C83.2 U23.3)
VCC: FPGA (16 pins), Motors&Drivers (16 pins), Dribbler (6 pins), Power (12 pins), Switches (5 pins)
VDD_nRF: NRF&Gyro (5 pins), MCU (11 pins)
BT-ADC: Switches (R19.1 R20.2), MCU (U35.40)
BTN1: Switches (S_D_1.2), MCU (U35.18)
BTN2: Switches (S_D_2.2), MCU (U35.19)
buzzer: Switches (R23.2), MCU (U35.29)
CAP_ADC: FPGA (R26.1 R27.1), MCU (U35.41)
CUR_M1: Motors&Drivers (U32.7), MCU (U35.43)
CUR_M2: Motors&Drivers (U31.7), MCU (U35.5)
CUR_M3: Motors&Drivers (U33.7), MCU (U35.4)
CUR_M4: Motors&Drivers (U34.7), MCU (U35.42)
CUR_MD: Dribbler (U28.7), MCU (U35.6)
D_IO2: FPGA (U5.41), Switches (RS1.8 S_SET.8)
D_IO3: FPGA (U5.44), Switches (RS1.6 S_SET.7)
D_IO4: FPGA (U5.46), Switches (RS1.4 S_SET.6)
D_IO5: FPGA (U5.47), Switches (RS1.2 S_SET.5)
D_IO6: FPGA (U5.50), Switches (D_D_4.1)
D_IO7: FPGA (U5.51), MCU (U35.17)
D_IO8: FPGA (U5.52), MCU (U35.16)
D_IO9: FPGA (U5.53), MCU (U35.15)
D_IO10: FPGA (U5.55), NRF&Gyro (nRF.2 R127.2 U30.8), MCU (U35.14)
D_IO11: FPGA (U5.56), NRF&Gyro (nRF.3 U30.7), MCU (U35.12)
D_IO12: FPGA (U5.57), NRF&Gyro (nRF.4 R156.1 U30.6), MCU (U35.11)
D_IO13: FPGA (U5.59), NRF&Gyro (nRF.5 R157.1 U30.5), MCU (U35.10)
D_IO14: FPGA (U5.60), NRF&Gyro (nRF.6 R158.2 U30.4), MCU (U35.9)
D_IO15_1: FPGA (U5.63), NRF&Gyro (nRF.7 R128.2 U30.3), MCU (U35.8)
Gyro1: FPGA (U5.33), NRF&Gyro (Gyro_&_Accel.4 R155.1)
Gyro2: FPGA (U5.130), NRF&Gyro (Gyro_&_Accel.3 R159.1)
Gyro3: FPGA (U5.129), NRF&Gyro (Gyro_&_Accel.2 R149.2)
Gyro4: FPGA (U5.127), NRF&Gyro (Gyro_&_Accel.1 R150.2)
H1_1: FPGA (U3.9), Motors&Drivers (MOTOR_1.1 P5.2)
H1_2: FPGA (U3.8), Motors&Drivers (MOTOR_1.2 P5.3)
H1_3: FPGA (U3.7), Motors&Drivers (MOTOR_1.3 P5.4)
H2_1: FPGA (U2.2), Motors&Drivers (MOTOR_2.1 P6.2)
H2_2: FPGA (U2.3), Motors&Drivers (MOTOR_2.2 P6.3)
H2_3: FPGA (U2.4), Motors&Drivers (MOTOR_2.3 P6.4)
H3_1: FPGA (U1.9), Motors&Drivers (MOTOR_3.1 P7.2)
H3_2: FPGA (U1.8), Motors&Drivers (MOTOR_3.2 P7.3)
H3_3: FPGA (U1.7), Motors&Drivers (MOTOR_3.3 P7.4)
H4_1: FPGA (U4.2), Motors&Drivers (MOTOR_4.3 P8.2)
H4_2: FPGA (U4.3), Motors&Drivers (MOTOR_4.2 P8.3)
H4_3: FPGA (U4.4), Motors&Drivers (MOTOR_4.1 P8.4)
Hd_1: FPGA (U24.7), Dribbler (Dribbler.1 R40.2)
Hd_2: FPGA (U24.8), Dribbler (Dribbler.2 R41.2)
Hd_3: FPGA (U24.9), Dribbler (Dribbler.3 R42.2)
ID0: Switches (S_ID.1), MCU (U35.23)
ID1: Switches (S_ID.4), MCU (U35.20)
ID2: Switches (S_ID.3), MCU (U35.21)
ID3: Switches (S_ID.6), MCU (U35.22)
LED1: Switches (D_D_1.1), MCU (U35.24)
LED2: Switches (D_D_2.1), MCU (U35.27)
LED3: Switches (D_D_3.1), MCU (U35.28)
M1_1: FPGA (RS2.6 RS19.5), Motors&Drivers (U9.2)
M1_2: FPGA (RS2.8 RS19.7), Motors&Drivers (U9.4)
M1_3: FPGA (RS2.2 RS19.1), Motors&Drivers (U11.2)
M1_4: FPGA (RS2.4 RS19.3), Motors&Drivers (U11.4)
M1_5: FPGA (RS5.6 RS15.3), Motors&Drivers (U13.2)
M1_6: FPGA (RS5.8 RS15.1), Motors&Drivers (U13.4)
M2_1: FPGA (RS6.2 RS14.7), Motors&Drivers (U6.2)
M2_2: FPGA (RS6.4 RS14.5), Motors&Drivers (U6.4)
M2_3: FPGA (RS4.6 RS21.4), Motors&Drivers (U16.2)
M2_4: FPGA (RS4.8 RS21.2), Motors&Drivers (U16.4)
M2_5: FPGA (RS4.2 RS21.8), Motors&Drivers (U18.2)
M2_6: FPGA (RS4.4 RS21.6), Motors&Drivers (U18.4)
M3_1: FPGA (RS3.7 RS18.1), Motors&Drivers (U14.2)
M3_2: FPGA (RS3.5 RS18.3), Motors&Drivers (U14.4)
M3_3: FPGA (RS8.3 RS13.5), Motors&Drivers (U20.2)
M3_4: FPGA (RS8.1 RS13.7), Motors&Drivers (U20.4)
M3_5: FPGA (RS3.3 RS18.5), Motors&Drivers (U12.2)
M3_6: FPGA (RS3.1 RS18.7), Motors&Drivers (U12.4)
M4_1: FPGA (RS11.2 RS20.4), Motors&Drivers (U15.2)
M4_2: FPGA (RS11.4 RS20.2), Motors&Drivers (U15.4)
M4_3: FPGA (RS9.6 RS16.4), Motors&Drivers (U17.2)
M4_4: FPGA (RS9.8 RS16.2), Motors&Drivers (U17.4)
M4_5: FPGA (RS9.2 RS16.8), Motors&Drivers (U19.2)
M4_6: FPGA (RS9.4 RS16.6), Motors&Drivers (U19.4)
Md_1: FPGA (RS7.3 RS12.5), Dribbler (U10.2)
Md_2: FPGA (RS7.1 RS12.7), Dribbler (U10.4)
Md_3: FPGA (RS7.7 RS12.1), Dribbler (U8.2)
Md_4: FPGA (RS7.5 RS12.3), Dribbler (U8.4)
Md_5: FPGA (RS6.6 RS17.8), Dribbler (U7.2)
Md_6: FPGA (RS6.8 RS17.6), Dribbler (U7.4)
P0.00/XL1: FPGA (U5.74), MCU (U35.2)
P0.01/XL2: FPGA (U5.73), MCU (U35.3)
P0.05/AIN3: Power (R9.1), MCU (U35.7)